# Altium project FocDriver.PrjPcb
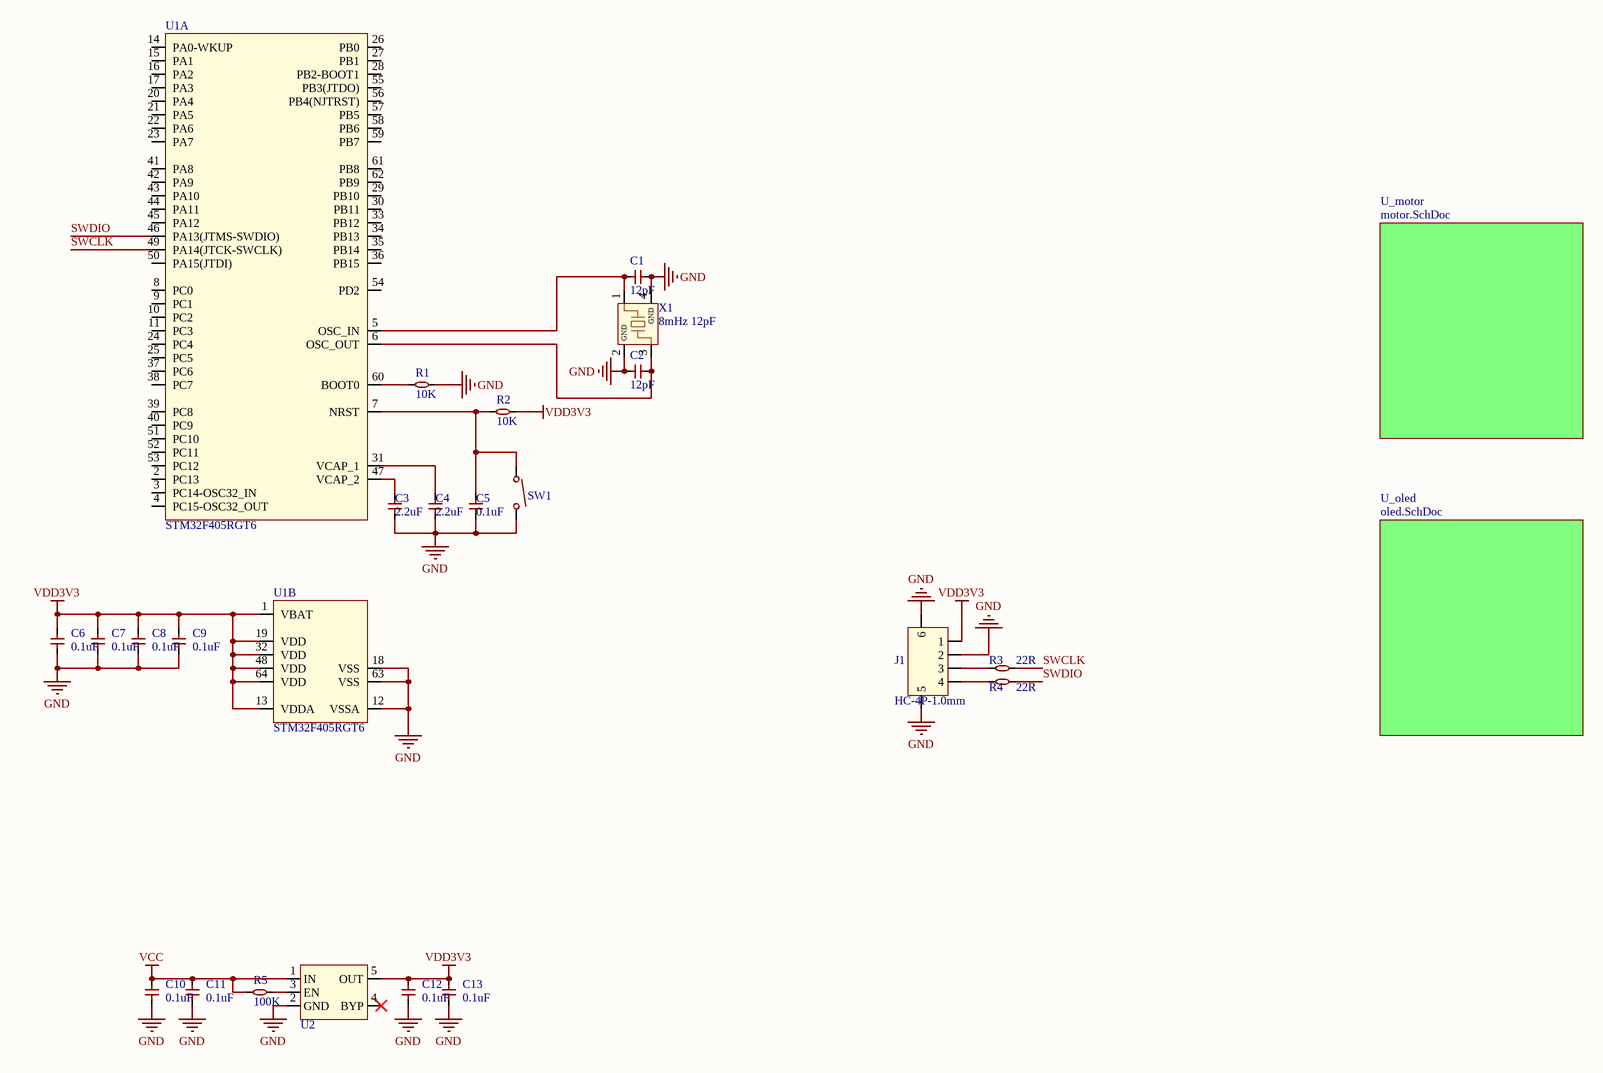
[diagram p0: main.SchDoc]
3 sheets, 70 parts. Net scope: flat (ports and power ports of the same name join across sheets).
Board file: FocDriver.PcbDoc
Sheets:
  main.SchDoc
    U_motor = motor.SchDoc
    U_oled = oled.SchDoc

## Sheet main.SchDoc
size A3; SheetNumber: 1; SheetTotal: 3

### Parts
C1  12pF  [C0402]
C2  12pF  [C0402]
C3  2.2uF  [C0402]
C4  2.2uF  [C0402]
C5  0.1uF  [C0402]
C6  0.1uF  [C0402]
C7  0.1uF  [C0402]
C8  0.1uF  [C0402]
C9  0.1uF  [C0402]
C10  0.1uF  [C0402]
C11  0.1uF  [C0402]
C12  0.1uF  [C0402]
C13  0.1uF  [C0402]
J1  HC-4P-1.0mm
R1  10K  [R0402_1]
R2  10K  [R0402_1]
R3  22R  [R0402_1]
R4  22R  [R0402_1]
R5  100K  [R0402_1]
SW1  3*4两脚按键  [SW-SMD_L4.0-W2.9-LS5.0]  (value not drawn)
U1  STM32F405RGT6  [LQFP-64_L10.0-W10.0-P0.50]  (parts A,B of 2)
U2  SPX3819M5-L-3-3/TR  [SOT-23-5_L3.0-W1.7-P0.95-LS2.8-BR]  (value not drawn)
X1  8mHz 12pF

### Sub-sheets
U_motor = motor.SchDoc: no entries
U_oled = oled.SchDoc: no entries

### Nets
GND: C1.2 C2.2 C3.2 C4.2 C5.1 C6.2 C7.2 C8.2 C9.2 C10.2 C11.2 C12.2 C13.2 J1.2 J1.5 J1.6 R1.2 SW1.2 U1.12(VSSA) U1.18(VSS) U1.63(VSS) U2.2(GND) X1.2(GND) X1.4(GND)
VCC: C10.1 C11.1 R5.2 U2.1(IN)
VDD3V3: C6.1 C7.1 C8.1 C9.1 C12.1 C13.1 J1.1 R2.2 U1.1(VBAT) U1.13(VDDA) U1.19(VDD) U1.32(VDD) U1.48(VDD) U1.64(VDD) U2.5(OUT)
SWCLK: R3.2 U1.49(PA14(JTCK-SWCLK))
SWDIO: R4.2 U1.46(PA13(JTMS-SWDIO))
NetC1_1: C1.1 U1.5(OSC_IN) X1.1
NetC2_1: C2.1 U1.6(OSC_OUT) X1.3
NetC3_1: C3.1 U1.47(VCAP_2)
NetC4_1: C4.1 U1.31(VCAP_1)
NetC5_2: C5.2 R2.1 SW1.1 U1.7(NRST)
NetJ1_3: J1.3 R3.1
NetJ1_4: J1.4 R4.1
NetR1_1: R1.1 U1.60(BOOT0)
NetR5_1: R5.1 U2.3(EN)

Not connected (* = marked no-connect by the designer): U1 2(PC13) 3(PC14-OSC32_IN) 4(PC15-OSC32_OUT) 8(PC0) 9(PC1) 10(PC2) 11(PC3) 14(PA0-WKUP) 15(PA1) 16(PA2) 17(PA3) 20(PA4) 21(PA5) 22(PA6) 23(PA7) 24(PC4) 25(PC5) 26(PB0) 27(PB1) 28(PB2-BOOT1) 29(PB10) 30(PB11) 33(PB12) 34(PB13) 35(PB14) 36(PB15) 37(PC6) 38(PC7) 39(PC8) 40(PC9) 41(PA8) 42(PA9) 43(PA10) 44(PA11) 45(PA12) 50(PA15(JTDI)) 51(PC10) 52(PC11) 53(PC12) 54(PD2) 55(PB3(JTDO)) 56(PB4(NJTRST)) 57(PB5) 58(PB6) 59(PB7) 61(PB8) 62(PB9); U2 4(BYP)*

### Library data of the parts
C1-C13 = CAP: 贴片电容; Manufacturer: SAMSUNG(三星); Manufacturer Part: CL05A105KP5NNND; Add into BOM: yes; Tolerance: ±10%; Voltage Rated: 10V; Temperature Coefficient: X5R; Symbol: CAP-0402; Device: cap-0402; LCSC Part Name: 1uF ±10% 10V; Supplier Part: C307414; Supplier Footprint: 0402; JLCPCB Part Class: Extended Part; Datasheet: https://atta.szlcsc.com/upload/public/pdf/source/20181009/C307414_0A02B57115E94FED95F0CB1E32115BFC.pdf; Supplier: LCSC; Convert to PCB: yes
J1 = HC-4P-1.0mm: 线对板连接器
R1-R5 = RES: 贴片电阻; Manufacturer: UNI-ROYAL(厚声); Manufacturer Part: 0402WGF1001TCE; Add into BOM: yes; Tolerance: ±1%; Power(Watts): 1/16W; Temperature Coefficient: ±100ppm/; Overload Voltage (Max): 50V; Symbol: RES-0402; Device: res-0402; LCSC Part Name: 1k ±1%; Supplier Part: C11702; Supplier Footprint: 0402; Datasheet: https://atta.szlcsc.com/upload/public/pdf/source/20200306/C422600_1E6D84923E4A46A82E41ADD87F860B5C.pdf; Supplier: LCSC; Convert to PCB: yes; Type: 厚膜电阻; Operating Temperature Range: -55~+155; JLCPCB Part Class: 基础库
SW1 = Switch: 3*4两脚贴片不带柱; Manufacturer: BRIGHT(博瑞泰); Symbol: TSA343G00-250J2; Device: 3*4两脚按键不带柱; Add into BOM: yes; Contact Current: 50mA; Voltage Rating (DC): 12V; Insulation Resistance: 100M; Circuit: 单刀单掷; Actuator Style: 圆形按钮; Actuator/Cap Color: 黑色; With Lamp: 无; Operating Force: 250gf@±50gf; Mechanical Life: 50000; Pin Style: SMD接片; Switch Length: 3.95mm; Switch Width: 2.9mm; Switch Height: 2mm; Strike Gundam: 否; LCSC Part Name: 3*4 两脚小龟不带柱  250gf; Supplier Part: C354946; Manufacturer Part: TSA343G00-250J2; Supplier Footprint: SMD; Datasheet: https://atta.szlcsc.com/upload/public/pdf/source/20190426/C354946_6B70DFBDFA823D17B8EB46FB9599F693.pdf; Supplier: LCSC; Convert to PCB: yes; Mounting Style: 立贴; Operating Temperature: -25~+70; JLCPCB Part Class: Extended Part
U1 = STM32F405RGT6: ST,MCU,CPU内核：ARM Cortex-M4 CPU最大主频：168MHz 程序存储容量：512KB 程序存储器类型：FLASH RAM总容量：192KB
U2 = SPX3819M5-L-3-3/TR: LDO输入电压:16V;输出电压:3.3V; Manufacturer: MaxLinear; Add into BOM: yes; Output Type: 固定; Output Polarity: 正; Number of Outputs: 1; Maximum Input Voltage: 16V; Output Voltage: 3.3V; Dropout Voltage: 700mV@(500mA); Output Current: 500mA; Power Supply Rejection Ratio (PRSS): 70dB; Symbol: SPX3819M5-L-3-3/TR; LCSC Part Name: Vin=16V Vout=3.3V 500mA 70dB; Supplier Part: C9055; Manufacturer Part: SPX3819M5-L-3-3/TR; Supplier Footprint: SOT-23-5; Datasheet: https://atta.szlcsc.com/upload/public/pdf/source/20160421/1461205045150.pdf; Supplier: LCSC; Convert to PCB: yes; JLCPCB Part Class: Extended Part
X1 = XTAL: 无源晶振  频率公差：±10ppm

## Sheet motor.SchDoc
size A4; SheetNumber: 3; SheetTotal: 3
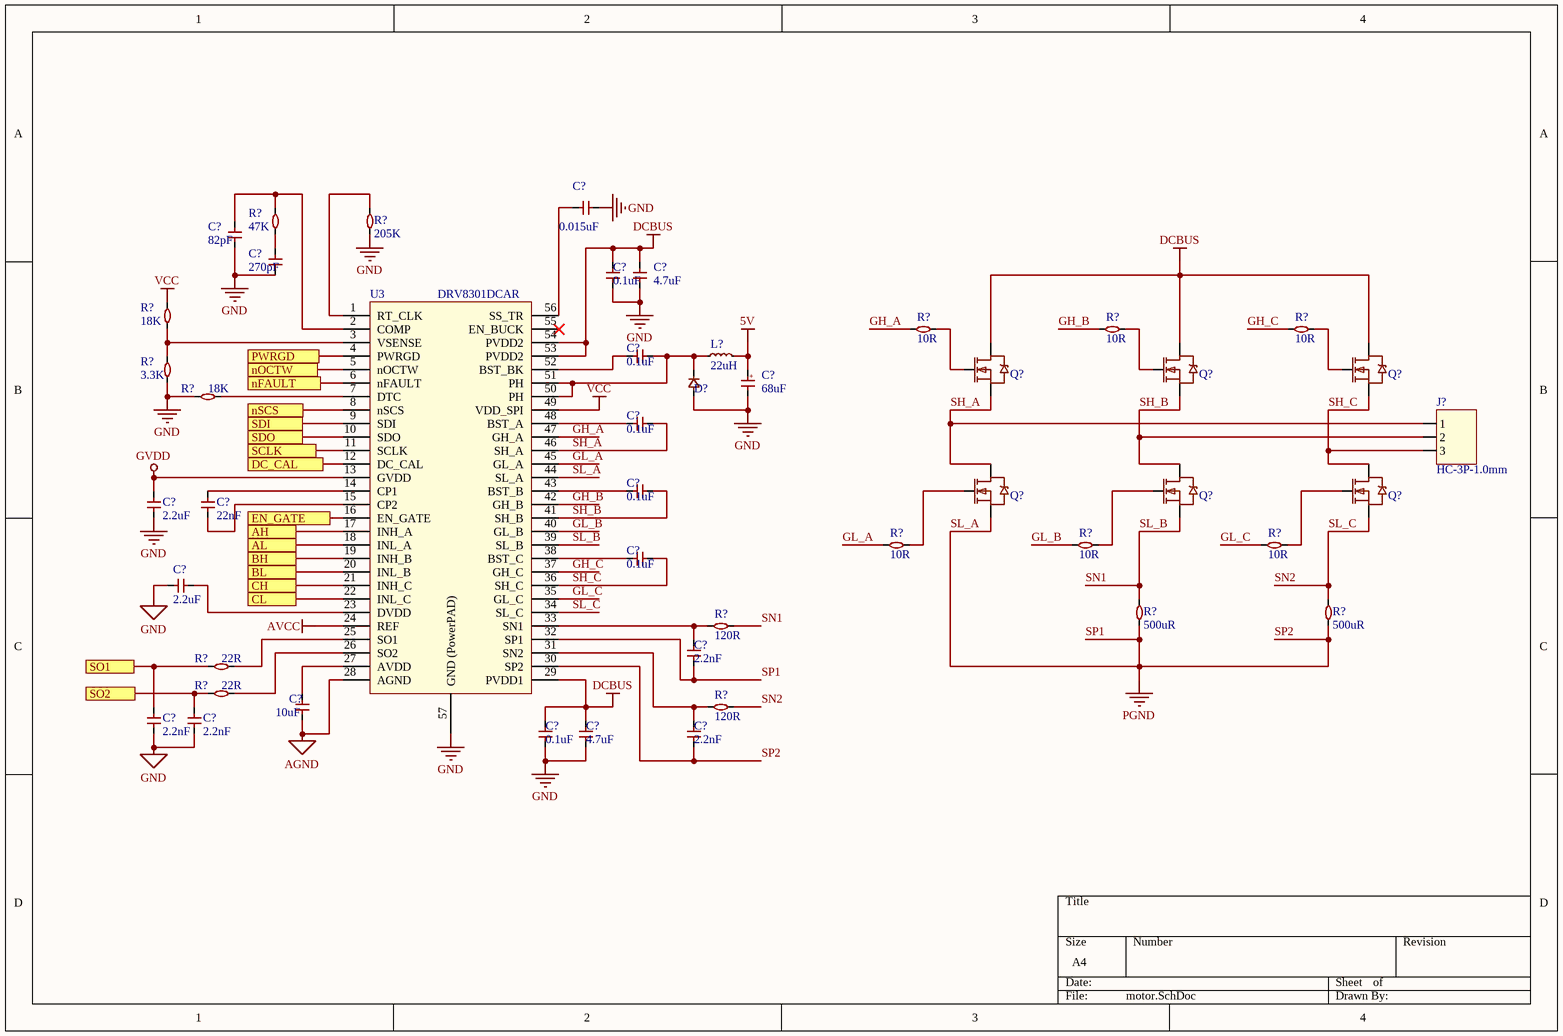
[diagram p1: motor.SchDoc]

### Parts
(Parts that share a designator on the sheet are numbered #1, #2 ... from top to bottom, then left to right.)
C?#1  0.015uF  [C0402]
C?#2  82pF  [C0402]
C?#3  270pF  [C0402]
C?#4  0.1uF  [C0402]
C?#5  4.7uF  [C0402]
C?#6  0.1uF  [C0402]
C?#7  68uF  [C0402]
C?#8  0.1uF  [C0402]
C?#9  0.1uF  [C0402]
C?#10  2.2uF  [C0402]
C?#11  22nF  [C0402]
C?#12  0.1uF  [C0402]
C?#13  2.2uF  [C0402]
C?#14  2.2nF  [C0402]
C?#15  10uF  [C0402]
C?#16  2.2nF  [C0402]
C?#17  2.2nF  [C0402]
C?#18  0.1uF  [C0402]
C?#19  4.7uF  [C0402]
C?#20  2.2nF  [C0402]
D?  DIO  [C0402]  (value not drawn)
J?  HC-3P-1.0mm
L?  22uH
Q?#1  AO3400A  [SOT-23-3_L2.9-W1.3-P1.90-LS2.4-BR]  (value not drawn)
Q?#2  AO3400A  [SOT-23-3_L2.9-W1.3-P1.90-LS2.4-BR]  (value not drawn)
Q?#3  AO3400A  [SOT-23-3_L2.9-W1.3-P1.90-LS2.4-BR]  (value not drawn)
Q?#4  AO3400A  [SOT-23-3_L2.9-W1.3-P1.90-LS2.4-BR]  (value not drawn)
Q?#5  AO3400A  [SOT-23-3_L2.9-W1.3-P1.90-LS2.4-BR]  (value not drawn)
Q?#6  AO3400A  [SOT-23-3_L2.9-W1.3-P1.90-LS2.4-BR]  (value not drawn)
R?#1  47K  [R0402_1]
R?#2  205K  [R0402_1]
R?#3  18K  [R0402_1]
R?#4  10R  [R0402_1]
R?#5  10R  [R0402_1]
R?#6  10R  [R0402_1]
R?#7  3.3K  [R0402_1]
R?#8  18K  [R0402_1]
R?#9  10R  [R0402_1]
R?#10  10R  [R0402_1]
R?#11  10R  [R0402_1]
R?#12  500uR  [R0402_1]
R?#13  500uR  [R0402_1]
R?#14  120R  [R0402_1]
R?#15  22R  [R0402_1]
R?#16  22R  [R0402_1]
R?#17  120R  [R0402_1]
U3  DRV8301DCAR

### Ports
AH, AL, BH, BL, CH, CL, DC_CAL, EN_GATE, nFAULT, nOCTW, nSCS, PWRGD, SCLK, SDI, SDO, SO1, SO2

### Nets
5V: C?#7.1 L?.2
AGND: C?#15.2 U3.28(AGND)
AVCC: U3.24(REF)
DCBUS: C?#4.1 C?#5.1 C?#18.1 C?#19.1 Q?#1.3(D) Q?#2.3(D) Q?#3.3(D) U3.29(PVDD1) U3.53(PVDD2) U3.54(PVDD2)
GND: C?#1.2 C?#2.1 C?#3.1 C?#4.2 C?#5.2 C?#7.2 C?#10.1 C?#13.1 C?#16.2 C?#17.2 C?#18.2 C?#19.2 D?.2 R?#2.2 R?#7.1 R?#8.1 U3.57(GND_(PowerPAD))
GVDD: C?#10.2 U3.13(GVDD)
SL_A: C?#14.2 C?#20.2 Q?#4.2(S) R?#12.2 R?#13.2 U3.30(SP2) U3.32(SP1) U3.44(SL_A)  [also labelled PGND, SP1, SP2]
VCC: R?#3.2 U3.49(VDD_SPI)
GH_A: R?#4.2 U3.47(GH_A)
GH_B: R?#5.2 U3.42(GH_B)
GH_C: R?#6.2 U3.37(GH_C)
GL_A: R?#9.2 U3.45(GL_A)
GL_B: R?#10.2 U3.40(GL_B)
GL_C: R?#11.2 U3.35(GL_C)
SH_A: C?#8.2 J?.1 Q?#1.2(S) Q?#4.3(D) U3.46(SH_A)
SH_B: C?#9.2 J?.2 Q?#2.2(S) Q?#5.3(D) U3.41(SH_B)
SH_C: C?#12.2 J?.3 Q?#3.2(S) Q?#6.3(D) U3.36(SH_C)
SL_B: Q?#5.2(S) R?#12.1 R?#14.2 U3.39(SL_B)  [also labelled SN1]
SL_C: Q?#6.2(S) R?#13.1 R?#17.2 U3.34(SL_C)  [also labelled SN2]
NetC?#1_1: C?#1.1 U3.56(SS_TR)
NetC?#2_2: C?#2.2 R?#1.1 U3.2(COMP)
NetC?#3_2: C?#3.2 R?#1.2
NetC?#6_1: C?#6.1 U3.52(BST_BK)
NetC?#6_2: C?#6.2 D?.1 L?.1 U3.50(PH) U3.51(PH)
NetC?#8_1: C?#8.1 U3.48(BST_A)
NetC?#9_1: C?#9.1 U3.43(BST_B)
NetC?#11_1: C?#11.1 U3.15(CP2)
NetC?#11_2: C?#11.2 U3.14(CP1)
NetC?#12_1: C?#12.1 U3.38(BST_C)
NetC?#13_2: C?#13.2 U3.23(DVDD)
NetC?#14_1: C?#14.1 R?#14.1 U3.33(SN1)
NetC?#15_1: C?#15.1 U3.27(AVDD)
NetC?#16_1: C?#16.1 R?#15.1 ; port SO1
NetC?#17_1: C?#17.1 R?#16.1 ; port SO2
NetC?#20_1: C?#20.1 R?#17.1 U3.31(SN2)
NetQ?#1_1: Q?#1.1(G) R?#4.1
NetQ?#2_1: Q?#2.1(G) R?#5.1
NetQ?#3_1: Q?#3.1(G) R?#6.1
NetQ?#4_1: Q?#4.1(G) R?#9.1
NetQ?#5_1: Q?#5.1(G) R?#10.1
NetQ?#6_1: Q?#6.1(G) R?#11.1
NetR?#2_1: R?#2.1 U3.1(RT_CLK)
NetR?#3_1: R?#3.1 R?#7.2 U3.3(VSENSE)
NetR?#8_2: R?#8.2 U3.7(DTC)
NetR?#15_2: R?#15.2 U3.25(SO1)
NetR?#16_2: R?#16.2 U3.26(SO2)
NetU3_4: U3.4(PWRGD) ; port PWRGD
NetU3_5: U3.5(nOCTW) ; port nOCTW
NetU3_6: U3.6(nFAULT) ; port nFAULT
NetU3_8: U3.8(nSCS) ; port nSCS
NetU3_9: U3.9(SDI) ; port SDI
NetU3_10: U3.10(SDO) ; port SDO
NetU3_11: U3.11(SCLK) ; port SCLK
NetU3_12: U3.12(DC_CAL) ; port DC_CAL
NetU3_16: U3.16(EN_GATE) ; port EN_GATE
NetU3_17: U3.17(INH_A) ; port AH
NetU3_18: U3.18(INL_A) ; port AL
NetU3_19: U3.19(INH_B) ; port BH
NetU3_20: U3.20(INL_B) ; port BL
NetU3_21: U3.21(INH_C) ; port CH
NetU3_22: U3.22(INL_C) ; port CL

Not connected (* = marked no-connect by the designer): U3 55(EN_BUCK)*

### Notes on the sheet
- (in symbol CAP+) +

### Library data of the parts
C?#1-C?#6 C?#8-C?#20 = CAP: as C1 on sheet main; Symbol: CAP-0402; Device: cap-0402; LCSC Part Name: 1uF ±10% 10V; Supplier Part: C307414; Supplier Footprint: 0402; JLCPCB Part Class: Extended Part; Datasheet: https://atta.szlcsc.com/upload/public/pdf/source/20181009/C307414_0A02B57115E94FED95F0CB1E32115BFC.pdf; Supplier: LCSC; Convert to PCB: yes
C?#7 = CAP+: 贴片型铝电解电容，50V; Manufacturer: SAMSUNG(三星); Manufacturer Part: CL05A105KP5NNND; Add into BOM: yes; Tolerance: ±10%; Voltage Rated: 10V; Temperature Coefficient: X5R; Symbol: CAP-0402; Device: cap-0402; LCSC Part Name: 1uF ±10% 10V; Supplier Part: C307414; Supplier Footprint: 0402; JLCPCB Part Class: Extended Part; Datasheet: https://atta.szlcsc.com/upload/public/pdf/source/20181009/C307414_0A02B57115E94FED95F0CB1E32115BFC.pdf; Supplier: LCSC; Convert to PCB: yes
D? = DIO: 通用二极管; Manufacturer: SAMSUNG(三星); Manufacturer Part: CL05A105KP5NNND; Add into BOM: yes; Tolerance: ±10%; Voltage Rated: 10V; Temperature Coefficient: X5R; Symbol: CAP-0402; Device: cap-0402; LCSC Part Name: 1uF ±10% 10V; Supplier Part: C307414; Supplier Footprint: 0402; JLCPCB Part Class: Extended Part; Datasheet: https://atta.szlcsc.com/upload/public/pdf/source/20181009/C307414_0A02B57115E94FED95F0CB1E32115BFC.pdf; Supplier: LCSC; Convert to PCB: yes
J? = HC-3P-1.0mm: 线对板连接器
L? = IND: 贴片电感
Q?#1-Q?#6 = NMOS: N沟道功率mos管; Manufacturer: BORN(伯恩半导体); Name: AO3401A; Symbol: AO3401A_C306862; Add into BOM: yes; Type: P沟道; Drain Source Voltage (Vdss): 30V; Continuous Drain Current (Id): 4.2A; Power Dissipation (Pd): 1.4W; Drain Source On Resistance (RDS(on)@Vgs,Id): 50mΩ@10V,4.1A; Gate Threshold Voltage (Vgs(th)@Id): 2V@250uA; Device: AO3401A_C306862; LCSC Part Name: P沟道 30V 4.2A; Supplier Part: C306862; Manufacturer Part: AO3401A; Supplier Footprint: SOT-23; JLCPCB Part Class: 扩展库; Datasheet: https://atta.szlcsc.com/upload/public/pdf/source/20190514/C306862_F7EF2FFF49BA48EA0D342955B5285B33.pdf; Supplier: LCSC; Convert to PCB: yes
R?#1-R?#17 = RES: as R1 on sheet main; Symbol: RES-0402; Device: res-0402; LCSC Part Name: 1k ±1%; Supplier Part: C11702; Supplier Footprint: 0402; Datasheet: https://atta.szlcsc.com/upload/public/pdf/source/20200306/C422600_1E6D84923E4A46A82E41ADD87F860B5C.pdf; Supplier: LCSC; Convert to PCB: yes; Type: 厚膜电阻; Operating Temperature Range: -55~+155; JLCPCB Part Class: 基础库
U3 = DRV8301DCAR: 三相电机/栅极驱动IC

## Sheet oled.SchDoc
size A4; SheetNumber: 3; SheetTotal: 3

## Nets that join several sheets
GND: main (24 pins), motor (17 pins)
VCC: main (C10.1 C11.1 R5.2 U2.1), motor (R?#3.2 U3.49)